# Altium schematic sheet SRAM_IDT7164SL_rev2.SchDoc
size A4
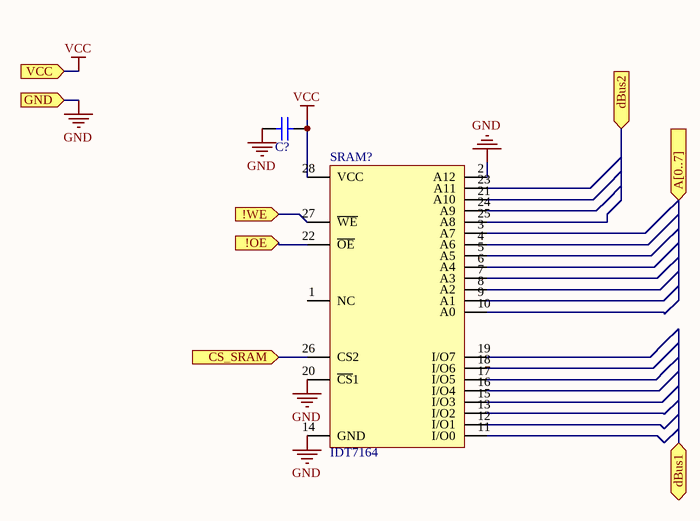
[diagram p0: SRAM_IDT7164SL_rev2.SchDoc]

## Parts
C?  0603 Cap  [0603 Capacitor]  (value not drawn)
SRAM?  IDT7164  [PDIP28]

## Ports
!OE (in), !WE (in), A[0..7] (in), CS_SRAM (in), dBus1 (bidir), dBus2 (in), GND (in), VCC (in)

## Nets
GND: C?.2 SRAM?.2(A12) SRAM?.14(GND) SRAM?.20(~{CS}1) ; port GND
VCC: C?.1 SRAM?.28(VCC) ; port VCC
!OE: SRAM?.22(~{OE}) ; port !OE
!WE: SRAM?.27(~{WE}) ; port !WE
CS_SRAM: SRAM?.26(CS2) ; port CS_SRAM

Not connected (* = marked no-connect by the designer): SRAM? 1(NC) 3(A7) 4(A6) 5(A5) 6(A4) 7(A3) 8(A2) 9(A1) 10(A0) 11(I/O0) 12(I/O1) 13(I/O2) 15(I/O3) 16(I/O4) 17(I/O5) 18(I/O6) 19(I/O7) 21(A10) 23(A11) 24(A9) 25(A8)

## Library data of the parts
C? = CMP-001-A20-6: value: *
SRAM? = 4509: id: 4509; pakke_opprettet_av: 1154; symbol_opprettet_av: 1855; beskrivelse: CMOS Static RAM 64K (8K x 8-Bit); pris: 0; nokkelord: SRAM Byggern; pakke_opprettet: 11.10.2016 17:43:12; symbol_opprettet: 13.09.2018 17:29:18; navn: IDT7164